# EAGLE design sistema min (EAGLE 7.6.0)
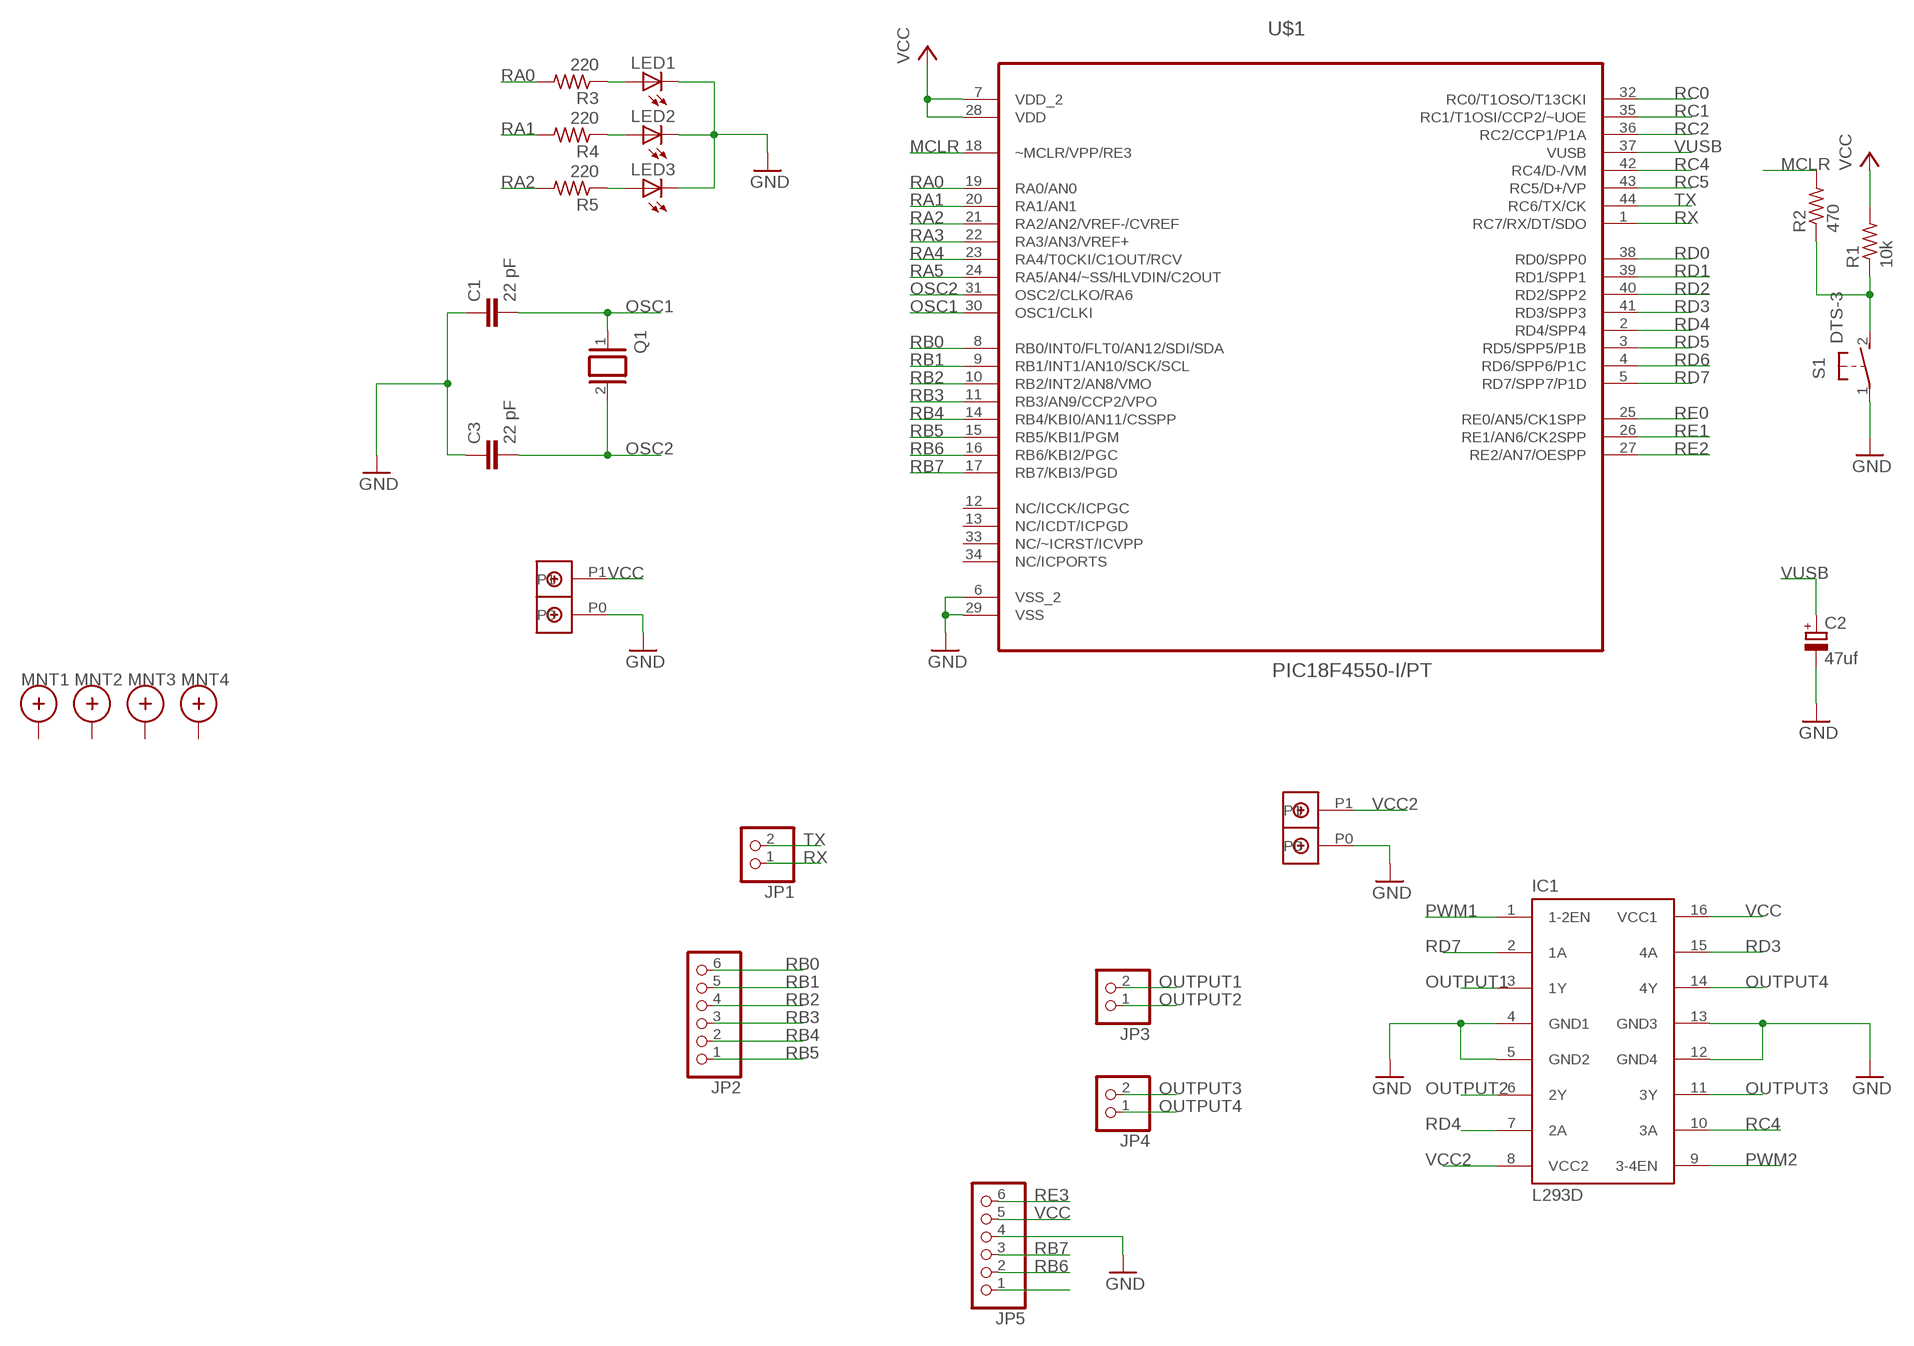
[diagram p0: schematic, sheet 1]

## Parts
C1  22 pF  C-EUC1206  [C1206]
C2  47uf  CPOL-EU153CLV-0605  [153CLV-0605]
C3  22 pF  C-EUC1206  [C1206]
IC1  L293D  [DIL16]
JP1  PINHD-1X2  [1X02]
JP2  PINHD-1X6  [1X06]
JP3  PINHD-1X2  [1X02]
JP4  PINHD-1X2  [1X02]
JP5  PINHD-1X6  [1X06]
LED1  LEDCHIPLED_1206  [CHIPLED_1206]
LED2  LEDCHIPLED_1206  [CHIPLED_1206]
LED3  LEDCHIPLED_1206  [CHIPLED_1206]
MNT1  HOLE_MNT_0.135  [HOLE_MNT_#5-40]
MNT2  HOLE_MNT_0.135  [HOLE_MNT_#5-40]
MNT3  HOLE_MNT_0.135  [HOLE_MNT_#5-40]
MNT4  HOLE_MNT_0.135  [HOLE_MNT_#5-40]
Q1  XTAL/S  [QS]
R1  10k  R-US_M1206  [M1206]
R2  470  R-US_M1206  [M1206]
R3  220  R-US_M1206  [M1206]
R4  220  R-US_M1206  [M1206]
R5  220  R-US_M1206  [M1206]
S1  DTS-3  [DTS-3]
U$1  PIC18F4550-I/PT  [QFP80P1200X1200X120-44N]
U$2  DBCONN-1X2  [DBCONN-1X2]
U$3  DBCONN-1X2  [DBCONN-1X2]

## Nets
GND: C1.1 C2.- C3.1 IC1.4(GND1) IC1.5(GND2) IC1.12(GND4) IC1.13(GND3) JP5.4 LED1.C LED2.C LED3.C S1.1 U$1.6(VSS_2) U$1.29(VSS) U$2.P0 U$3.P0
MCLR: R2.2 U$1.18(~MCLR/VPP/RE3)
N$3: R1.1 R2.1 S1.2
N$4: LED1.A R3.1
N$6: LED2.A R4.1
N$7: LED3.A R5.1
N$10: JP5.1
OSC1: C1.2 Q1.1 U$1.30(OSC1/CLKI)
OSC2: C3.2 Q1.2 U$1.31(OSC2/CLKO/RA6)
OUTPUT1: IC1.3(1Y) JP3.2
OUTPUT2: IC1.6(2Y) JP3.1
OUTPUT3: IC1.11(3Y) JP4.2
OUTPUT4: IC1.14(4Y) JP4.1
PWM1: IC1.1(1-2EN)
PWM2: IC1.9(3-4EN)
RA0: R3.2 U$1.19(RA0/AN0)
RA1: R4.2 U$1.20(RA1/AN1)
RA2: R5.2 U$1.21(RA2/AN2/VREF-/CVREF)
RA3: U$1.22(RA3/AN3/VREF+)
RA4: U$1.23(RA4/T0CKI/C1OUT/RCV)
RA5: U$1.24(RA5/AN4/~SS/HLVDIN/C2OUT)
RB0: JP2.6 U$1.8(RB0/INT0/FLT0/AN12/SDI/SDA)
RB1: JP2.5 U$1.9(RB1/INT1/AN10/SCK/SCL)
RB2: JP2.4 U$1.10(RB2/INT2/AN8/VMO)
RB3: JP2.3 U$1.11(RB3/AN9/CCP2/VPO)
RB4: JP2.2 U$1.14(RB4/KBI0/AN11/CSSPP)
RB5: JP2.1 U$1.15(RB5/KBI1/PGM)
RB6: JP5.2 U$1.16(RB6/KBI2/PGC)
RB7: JP5.3 U$1.17(RB7/KBI3/PGD)
RC0: U$1.32(RC0/T1OSO/T13CKI)
RC1: U$1.35(RC1/T1OSI/CCP2/~UOE)
RC2: U$1.36(RC2/CCP1/P1A)
RC4: IC1.10(3A) U$1.42(RC4/D-/VM)
RC5: U$1.43(RC5/D+/VP)
RD0: U$1.38(RD0/SPP0)
RD1: U$1.39(RD1/SPP1)
RD2: U$1.40(RD2/SPP2)
RD3: IC1.15(4A) U$1.41(RD3/SPP3)
RD4: IC1.7(2A) U$1.2(RD4/SPP4)
RD5: U$1.3(RD5/SPP5/P1B)
RD6: U$1.4(RD6/SPP6/P1C)
RD7: IC1.2(1A) U$1.5(RD7/SPP7/P1D)
RE0: U$1.25(RE0/AN5/CK1SPP)
RE1: U$1.26(RE1/AN6/CK2SPP)
RE2: U$1.27(RE2/AN7/OESPP)
RE3: JP5.6
RX: JP1.1 U$1.1(RC7/RX/DT/SDO)
TX: JP1.2 U$1.44(RC6/TX/CK)
VCC: IC1.16(VCC1) JP5.5 R1.2 U$1.7(VDD_2) U$1.28(VDD) U$2.P1
VCC2: IC1.8(VCC2) U$3.P1
VUSB: C2.+ U$1.37(VUSB)
Unconnected: MNT1.P$1 MNT2.P$1 MNT3.P$1 MNT4.P$1 U$1.12(NC/ICCK/ICPGC) U$1.13(NC/ICDT/ICPGD) U$1.33(NC/~ICRST/ICVPP) U$1.34(NC/ICPORTS)

## Library data of the parts
C1 C3 = rcl:C-EU: CAPACITOR, European symbol
C2 = rcl:CPOL-EU: POLARIZED CAPACITOR, European symbol
IC1 = st-microelectronics:L293D: PUSH-PULL 4 CHANNEL DRIVER; MPN: L293D; OC_FARNELL: 9589619; OC_NEWARK: 56P8249
JP1 JP3 JP4 = pinhead:PINHD-1X2: PIN HEADER
JP2 JP5 = pinhead:PINHD-1X6: PIN HEADER
LED1-LED3 = led:LED: LED OSRAM: - CHIPLED LG R971, LG N971, LY N971, LG Q971, LY Q971, LO R971, LY R971 LH N974, LH R974 LS Q976, LO Q976, LY Q976 LO Q996 - Hyper CHIPLED LW Q18S LB Q993, LB Q99A, LB R99A - SideLED LS A670, LO A670, LY A670, LG A670, LP A670 LB A673, LV A673, LT A673, LW A673 LH A674 LY A675 LS A676, LA A676, LO A676, LY A676, LW A676 LS A679, LY A679, LG A679 - Hyper Micro SIDELED® LS Y876, LA Y876, LO Y876, LY Y876 LT Y87S - SmartLED LW L88C, LW L88S LB L89C, LB L89S, LG L890 LS L89K, LO L89K, LY L89K LS L896, LA L896, LO L896, LY L896 - TOPLED LS T670, LO T670, LY T670, LG T670, LP T670 LSG T670, LSP T670, LSY T670, LOP T670, LYG T670 LG T671, LOG T671, LSG T671 LB T673, LV T673, LT T673, LW T673 LH T674 LS T676, LA T676, LO T676, LY T676, LB T676, LH T676, LSB T676, LW T676 LB T67C, LV T67C, LT T67C, LS T67K, LO T67K, LY T67K, LW E67C LS E67B, LA E67B, LO E67B, LY E67B, LB E67C, LV E67C, LT E67C LW T67C LS T679, LY T679, LG T679 LS T770, LO T770, LY T770, LG T770, LP T770 LB T773, LV T773, LT T773, LW T773 LH T774 LS E675, LA E675, LY E675, LS T675 LS T776, LA T776, LO T776, LY T776, LB T776 LHGB T686 LT T68C, LB T68C - Hyper Mini TOPLED® LB M676 - Mini TOPLED Santana® LG M470 LS M47K, LO M47K, LY M47K Source: http://www.osram.convergy.de LUXEON: - LUMILED® LXK2-PW12-R00, LXK2-PW12-S00, LXK2-PW14-U00, LXK2-PW14-V00 LXK2-PM12-R00, LXK2-PM12-S00, LXK2-PM14-U00 LXK2-PE12-Q00, LXK2-PE12-R00, LXK2-PE12-S00, LXK2-PE14-T00, LXK2-PE14-U00 LXK2-PB12-K00, LXK2-PB12-L00, LXK2-PB12-M00, LXK2-PB14-N00, LXK2-PB14-P00, LXK2-PB14-Q00 LXK2-PR12-L00, LXK2-PR12-M00, LXK2-PR14-Q00, LXK2-PR14-R00 LXK2-PD12-Q00, LXK2-PD12-R00, LXK2-PD12-S00 LXK2-PH12-R00, LXK2-PH12-S00 LXK2-PL12-P00, LXK2-PL12-Q00, LXK2-PL12-R00 Source: www.luxeon.com KINGBRIGHT: KA-3528ASYC Source: www.kingbright.com
MNT1-MNT4 = Existing Library:HOLE_MNT_0.135: Mounting Hole. 0.135 plated hole created for a #5-40 screw, McMaster p/n 91772A125
Q1 = special:XTAL/S: CRYSTAL
R1-R5 = resistor:R-US_: RESISTOR, American symbol
S1 = switch-tact:DTS-3
U$1 = Microchip_By_element14_Batch_1:PIC18F4550-I/PT: USB Microcontrollers; MPN: PIC18F4550-I/PT; OC_FARNELL: 9321365; OC_NEWARK: 08J9633; PACKAGE: QFP-44; SUPPLIER: Microchip
U$2 U$3 = Terminal Block Connector:DBCONN-1X2

## Board
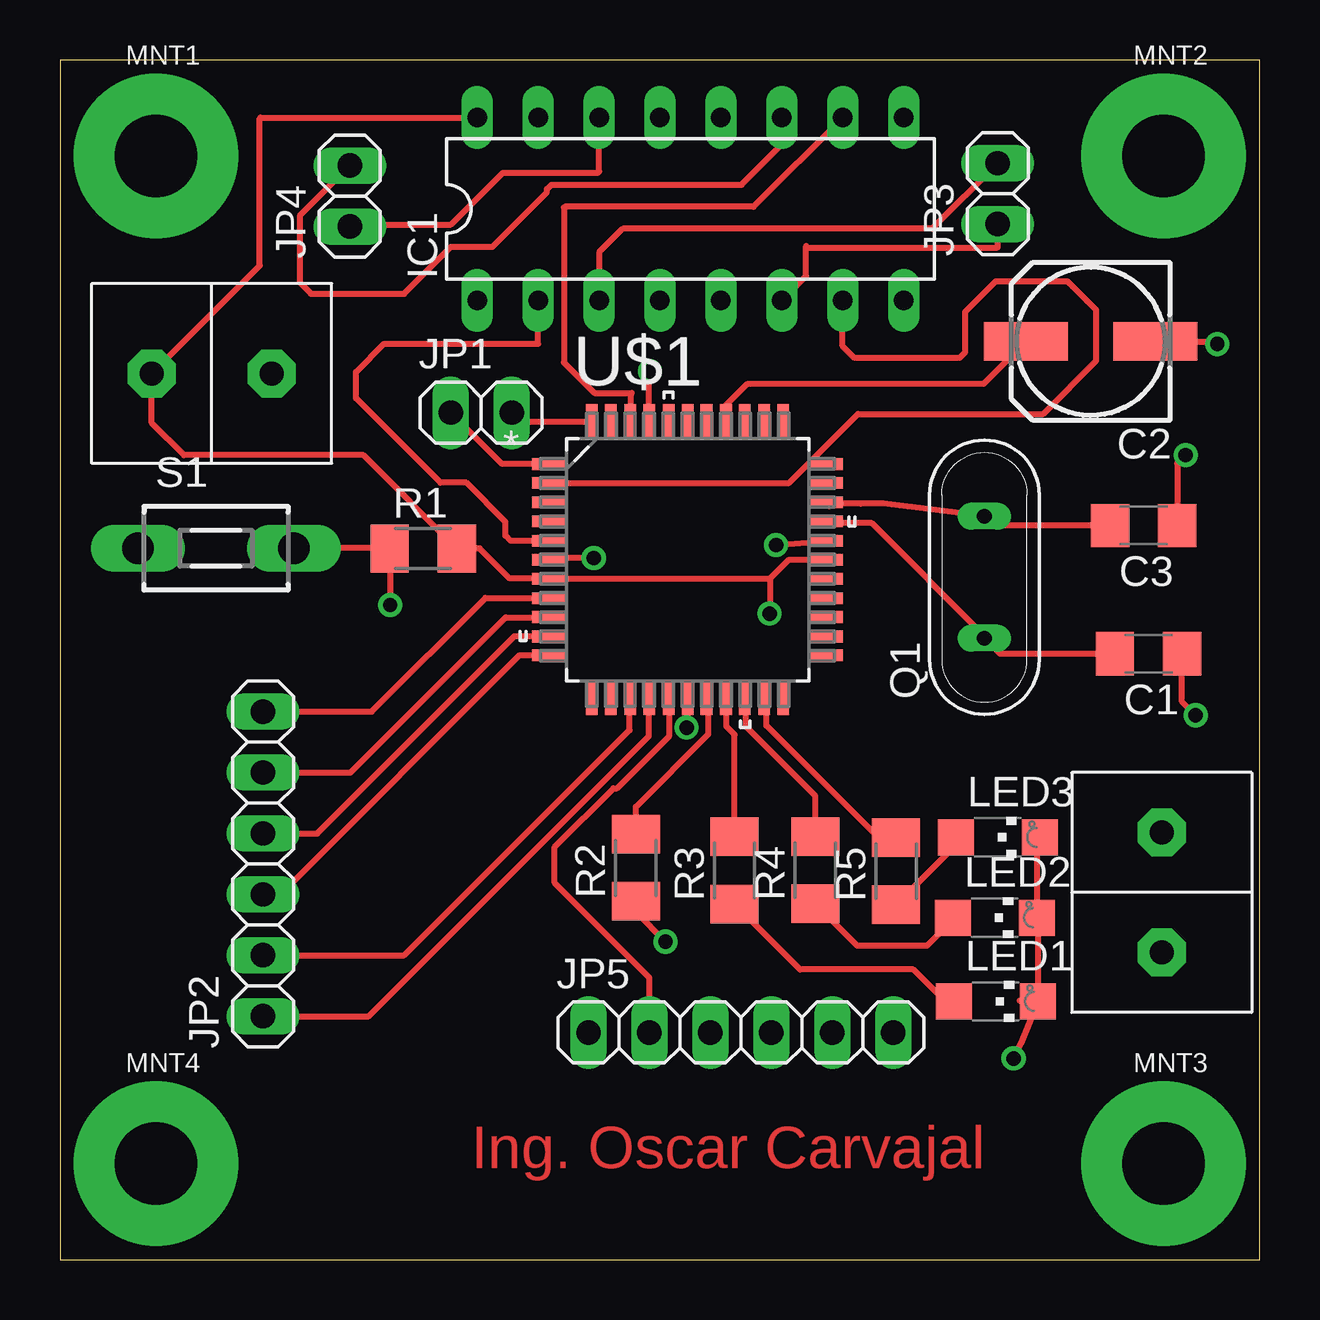
[diagram p1: board, top side]
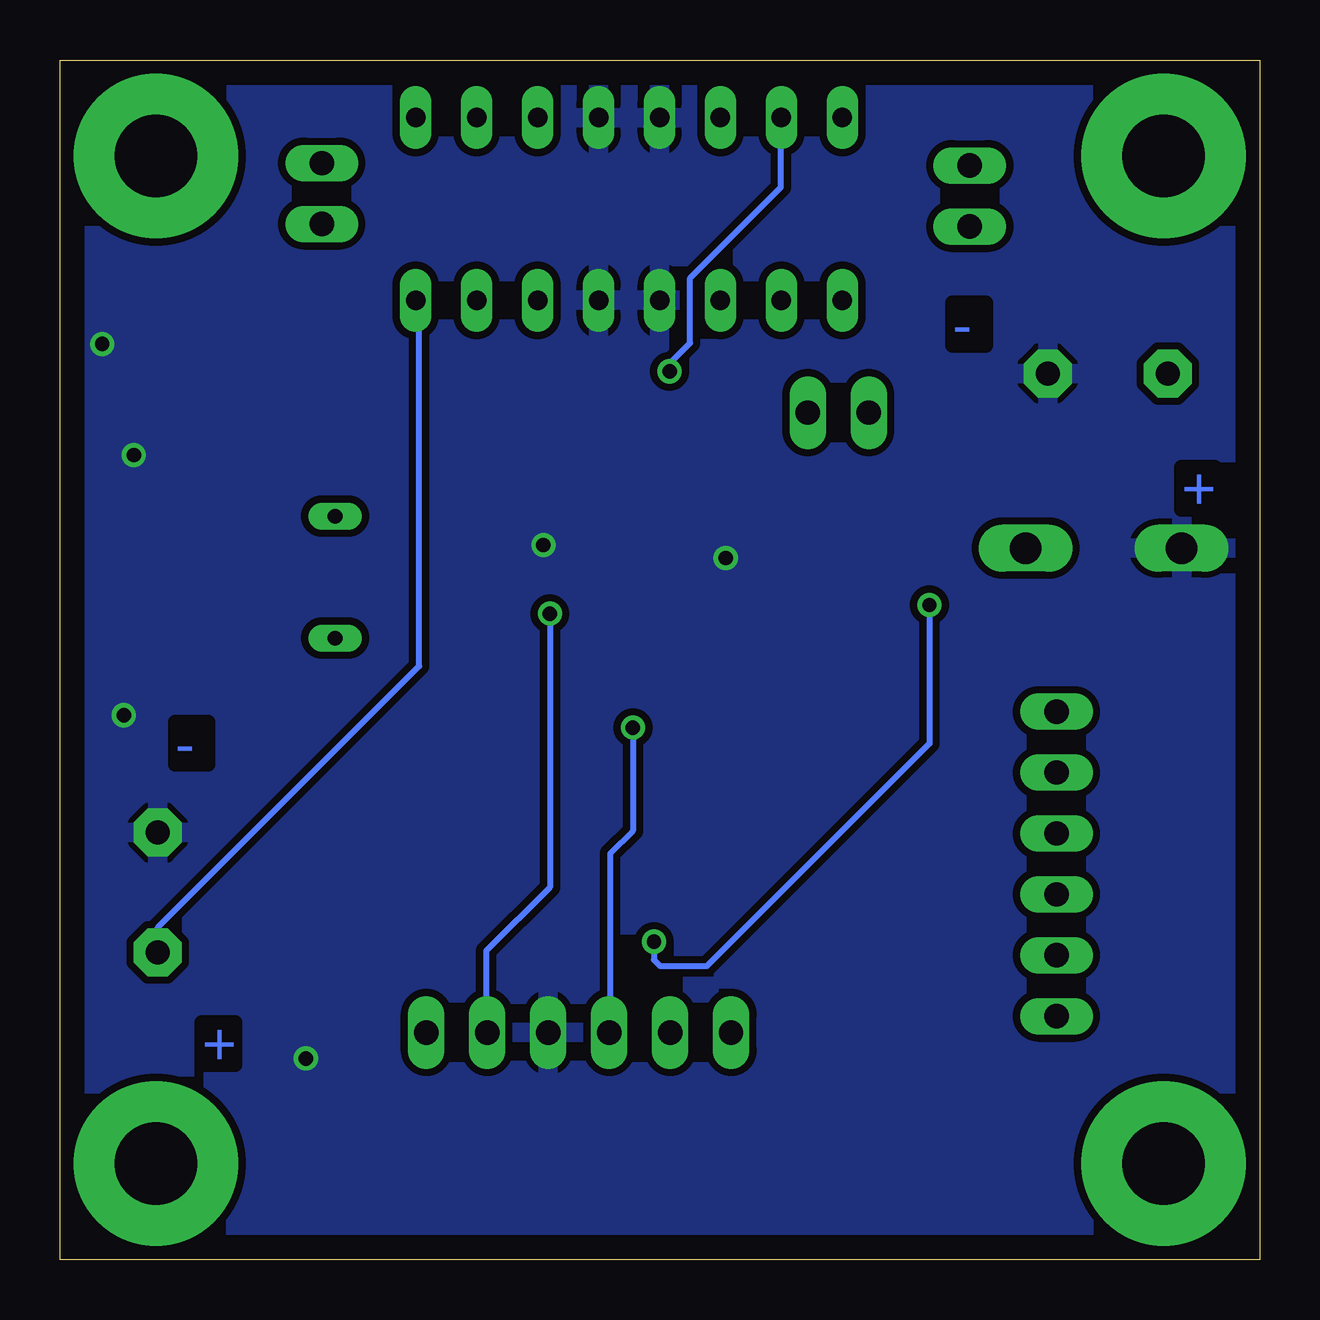
[diagram p2: board, bottom side, seen from below]

Size 50 x 50 mm. Coordinates in mm from the lower left corner, seen from the top.
Outline: 0,0 50,0 50,50 0,50 0,0
Copper layers (1*16): Top 0.035mm / dielectric 1.5mm / Bottom 0.035mm
Design rules "default": minimum track width 10mil, minimum drill 24mil, track to track 8mil, track to pad 8mil, pad to pad 8mil, via to via 8mil, smd to smd 8mil, copper to edge 40mil, drill to drill 8mil, minimum pad ring 10mil, minimum via ring 8mil, stop-mask expansion 4mil, vias tented up to drill 0mil, thermal gap 10mil

### Footprints (pad centres in the part's own frame; a part is rotated, then mirrored left to right if it is on the bottom)
C1206 = smd 1.6 x 1.8: 1 -1.4,0; 2 1.4,0
153CLV-0605 = smd 3.5 x 1.6: + 2.7,0; - -2.7,0
DIL16 = drill 0.813 long: 1 -8.89,-3.81; 2 -6.35,-3.81; 3 -3.81,-3.81; 4 -1.27,-3.81; 5 1.27,-3.81; 6 3.81,-3.81; 7 6.35,-3.81; 8 8.89,-3.81; 9 8.89,3.81; 10 6.35,3.81; 11 3.81,3.81; 12 1.27,3.81; 13 -1.27,3.81; 14 -3.81,3.81; 15 -6.35,3.81; 16 -8.89,3.81
1X02 = drill 1.016 long: 1 -1.27,0; 2 1.27,0
1X06 = drill 1.016 long: 1 -6.35,0; 2 -3.81,0; 3 -1.27,0; 4 1.27,0; 5 3.81,0; 6 6.35,0
CHIPLED_1206 = smd 1.5 x 1.5: A 0,-1.75; C 0,1.75
HOLE_MNT_#5-40 = drill 3.429 pad 6.858: P$1 0,0
QS = drill 0.61 long: 1 -2.54,0; 2 2.54,0
M1206 = smd 1.6 x 2: 1 -1.4,0; 2 1.4,0
DTS-3 = drill 1.3 long: 1 -3.25,0; 2 3.25,0
QFP80P1200X1200X120-44N = smd 1.473 x 0.483: 1 -5.74,3.988; 2 -5.74,3.2; 3 -5.74,2.388; 4 -5.74,1.6; 5 -5.74,0.787; 6 -5.74,0; 7 -5.74,-0.787; 8 -5.74,-1.6; 9 -5.74,-2.388; 10 -5.74,-3.2; 11 -5.74,-3.988; 23 5.74,-3.988; 24 5.74,-3.2; 25 5.74,-2.388; 26 5.74,-1.6; 27 5.74,-0.787; 28 5.74,0; 29 5.74,0.787; 30 5.74,1.6; 31 5.74,2.388; 32 5.74,3.2; 33 5.74,3.988 | smd 0.483 x 1.473: 12 -3.988,-5.74; 13 -3.2,-5.74; 14 -2.388,-5.74; 15 -1.6,-5.74; 16 -0.787,-5.74; 17 0,-5.74; 18 0.787,-5.74; 19 1.6,-5.74; 20 2.388,-5.74; 21 3.2,-5.74; 22 3.988,-5.74; 34 3.988,5.74; 35 3.2,5.74; 36 2.388,5.74; 37 1.6,5.74; 38 0.787,5.74; 39 0,5.74; 40 -0.787,5.74; 41 -1.6,5.74; 42 -2.388,5.74; 43 -3.2,5.74; 44 -3.988,5.74
DBCONN-1X2 = drill 1 pad 2 octagon: P0 -2.54,0; P1 2.46,0

### Placement (x,y rotation side)
C1  45.37,25.25 180 top
C2  42.96,38.27 180 top
C3  45.17,30.6 180 top
IC1  26.28,43.79 0 top
JP1  17.56,35.3 0 top
JP2  8.46,16.49 90 top
JP3  39.09,44.43 90 top
JP4  12.08,44.33 90 top
JP5  28.38,9.46 0 top
LED1  39,10.76 270 top
LED2  38.96,14.25 270 top
LED3  39.09,17.6 270 top
MNT1  4,46 0 top
MNT2  46,46 0 top
MNT3  46,4 0 top
MNT4  4,4 0 top
Q1  38.53,28.44 90 top
R1  15.14,29.64 0 top
R2  24,16.33 90 top
R3  28.12,16.22 90 top
R4  31.48,16.23 90 top
R5  34.85,16.19 90 top
S1  6.5,29.65 0 top
U$1  26.16,29.17 0 top
U$2  6.29,36.93 180 top
U$3  45.92,15.26 270 top

### Tracks (layer width: path | path; a pad name or v marks a point on that pad's centre or on a via)
GND  (via drill 0.6)
  Top 0.254: v22.25,29.24 20.42,29.24 U$1.6 | v29.85,29.78 U$1.29 | v46.92,33.53 46.57,33.18 C3.1 | v47.34,22.69 46.77,23.26 C1.1 | 40.14,14.38 LED2.C | 40.01,10.8 LED1.C | LED1.C 40.05,9.01 v39.75,8.38 | C2.- 48.13,38.27 v48.24,38.16 | LED3.C 40.71,17.6 LED2.C | LED2.C 40.75,14.25 LED1.C
  pour Bottom (isolate 0.305): 0.92,49.58 49.58,49.58 49.58,0.61 0.8,0.61 0.8,49.28
MCLR
  Top 0.254: R2.2 24,18.87 27.03,21.9 27.03,23.35 U$1.18
N$3  (via drill 0.6)
  Top 0.254: S1.2 R1.1 13.76,29.62 v13.76,27.28 | R2.1 24,14.49 v25.24,13.25
  Bottom 0.254: v13.76,27.28 13.76,21.51 23.05,12.22 24.97,12.22 25.24,12.49 v25.24,13.25
N$4
  Top 0.254: LED1.A 36.9,10.76 35.57,12.09 30.85,12.09 R3.1
N$6
  Top 0.254: LED2.A 37.31,14.25 36.14,13.08 33.23,13.08 R4.1
N$7
  Top 0.254: LED3.A 37.66,17.6 R5.1
OSC1
  Top 0.254: C1.2 39.18,25.25 Q1.1 38.53,26 33.84,30.69 31.98,30.69 U$1.30
OSC2
  Top 0.254: C3.2 38.91,30.6 Q1.2 34.33,31.52 33.38,31.51 31.95,31.51 U$1.31 32.06,31.4
OUTPUT1
  Top 0.254: JP3.2 36.35,42.96 23.45,42.96 22.47,41.98 IC1.3
OUTPUT2
  Top 0.254: IC1.6 31.1,40.99 31.1,42.25 31.17,42.18 39.08,42.18 39.09,42.19 JP3.1
OUTPUT3
  Top 0.254: JP4.2 9.99,43.51 9.99,40.73 10.46,40.26 14.35,40.26 16.3,42.21 18.03,42.21 20.3,44.48 20.3,44.62 20.48,44.8 28.41,44.8 30.09,46.48 IC1.11
OUTPUT4
  Top 0.254: JP4.1 12.16,43.14 16.3,43.14 18.46,45.3 22.42,45.3 22.47,45.35 IC1.14
RA0
  Top 0.254: R3.2 28.12,21.88 27.78,22.22 27.78,23.41 U$1.19
RA1
  Top 0.254: R4.2 31.48,19.33 28.59,22.22 28.59,22.72 28.45,22.86 28.45,23.33 U$1.20
RA2
  Top 0.254: R5.2 34.11,17.59 29.44,22.26 29.44,23.35 U$1.21
RB0
  Top 0.254: JP2.6 12.99,22.84 17.73,27.58 20.41,27.58 U$1.8
RB1
  Top 0.254: JP2.5 12.11,20.3 18.58,26.77 20.41,26.77 U$1.9
RB2
  Top 0.254: JP2.4 10.72,17.76 18.94,25.98 20.41,25.98 U$1.10
RB3
  Top 0.254: JP2.3 9.19,15.22 19.16,25.19 U$1.11
RB4
  Top 0.254: JP2.2 14.35,12.68 23.74,22.07 23.74,23.4 U$1.14
RB5
  Top 0.254: JP2.1 12.87,10.14 24.55,21.82 U$1.15
RB6
  Top 0.254: JP5.2 24.57,11.75 20.62,15.7 20.62,17.19 23.07,19.64 23.21,19.64 25.4,21.83 25.4,23.4 U$1.16
RB7  (via drill 0.6)
  Top 0.254: U$1.17 26.16,22.21 v26.12,22.17
  Bottom 0.254: v26.12,22.17 26.12,17.87 27.07,16.92 27.07,9.5 JP5.3
RC4
  Top 0.254: IC1.10 28.91,43.88 21.04,43.88 21.01,43.85 21.01,37.39 22.28,36.12 23.84,36.12 23.77,36.05 U$1.42
RD3  (via drill 0.6)
  Top 0.254: U$1.41 24.56,36.99 v24.59,37.02
  Bottom 0.254: v24.59,37.02 24.59,37.34 23.73,38.2 23.73,40.91 19.95,44.69 19.95,47.58 IC1.15
RD4
  Top 0.254: U$1.2 30.39,32.37 33.27,35.25 40.98,35.25 43.19,37.46 43.19,39.58 42,40.77 38.99,40.77 37.72,39.5 37.72,37.81 37.49,37.58 33.12,37.58 32.62,38.08 IC1.7
RD7
  Top 0.254: U$1.5 18.78,29.96 18.57,30.17 18.57,30.75 16.94,32.38 15.86,32.38 12.34,35.9 12.34,36.99 13.52,38.17 19.93,38.17 IC1.2
RX
  Top 0.254: U$1.1 18.43,33.16 JP1.1
TX
  Top 0.254: U$1.44 19.22,34.91 JP1.2
VCC  (via drill 0.6)
  Top 0.254: 29.6,28.38 U$1.7 18.74,28.39 17.49,29.64 R1.2 12.65,33.53 5.17,33.53 3.83,34.87 U$2.P1 8.33,41.43 8.33,47.57 8.36,47.6 IC1.16 | 29.6,28.38 30.39,29.17 U$1.28 | 29.6,28.38 29.6,26.94 v29.58,26.92
  Bottom 0.254: v29.58,26.92 29.58,15.52 32.23,12.87 32.23,9.5 JP5.5
VCC2
  Bottom 0.254: U$3.P1 45.92,13.84 35.03,24.73 35.03,39.84 IC1.8
VUSB
  Top 0.254: U$1.37 27.76,35.61 28.66,36.51 38.5,36.51 C2.+

### Text on the board
Top: Ing. Oscar Carvajal
Bottom: - | + | - | +